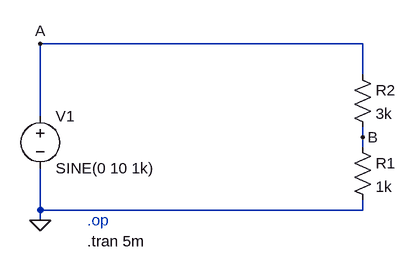
[diagram p0: schematic Exemplo_CA.asc]
Exemplo_CA.asc, the LTspice schematic file:
Version 4
SHEET 1 880 680
WIRE 112 -48 -384 -48
WIRE 112 0 112 -48
WIRE -384 64 -384 -48
WIRE 112 96 112 80
WIRE 112 112 112 96
WIRE -384 208 -384 144
WIRE 112 208 112 192
WIRE 112 208 -384 208
WIRE -384 224 -384 208
FLAG -384 224 0
FLAG -384 -48 A
FLAG 112 96 B
SYMBOL res 96 96 R0
SYMATTR InstName R1
SYMATTR Value 1k
SYMBOL res 96 -16 R0
SYMATTR InstName R2
SYMATTR Value 3k
SYMBOL voltage -384 48 R0
WINDOW 123 0 0 Left 0
WINDOW 39 0 0 Left 0
SYMATTR InstName V1
SYMATTR Value SINE(0 10 1k)
TEXT -312 224 Left 2 ;.op
TEXT -312 256 Left 2 !.tran 5m

The netlist it stands for:
* Exemplo_CA.asc
R1 B 0 1k
R2 A B 3k
V1 A 0 SINE(0 10 1k)
* .op
.tran 5m
.backanno
.end

* Results of the author's LTspice run, read from the files saved beside the schematic
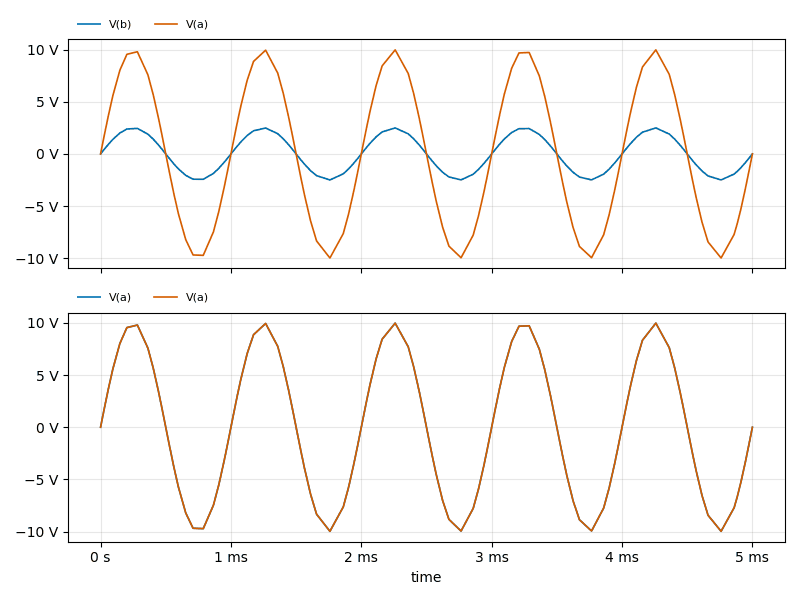
[diagram p1: Transient Analysis of Exemplo_CA.asc, plotted from the saved traces]
* Transient Analysis, 1 run:
*   V(b): min -2.493 V, max 2.493 V, average 647.1 µV, rms 1.74 V, last 0 V
*   V(a): min -9.973 V, max 9.973 V, average 2.589 mV, rms 6.962 V, last 0 V
*   V(a): min -9.973 V, max 9.973 V, average 2.589 mV, rms 6.962 V, last 0 V
*   V(a): min -9.973 V, max 9.973 V, average 2.589 mV, rms 6.962 V, last 0 V